# Altium schematic sheet ESP32headerboard.SchDoc
size A4; SheetNumber: 1; SheetTotal: 1
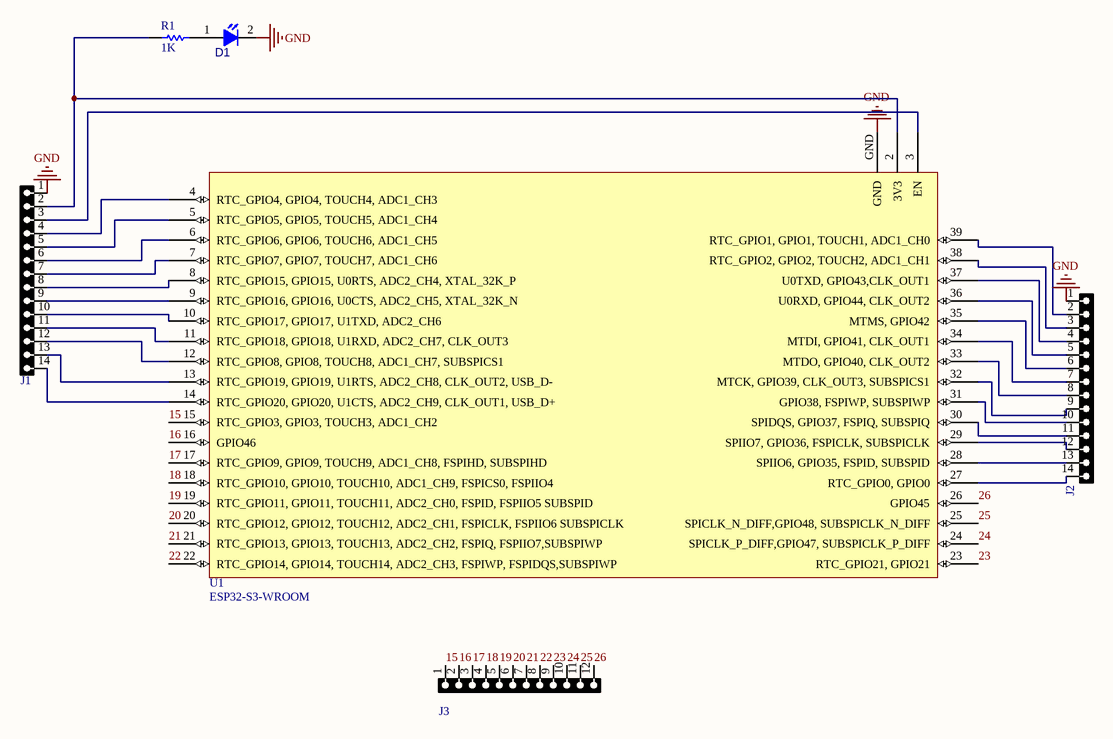
[diagram p0: ESP32headerboard.SchDoc]

## Parts
D1  LED SMD 1206  [LED SMD 1206 (Blue)]  (value not drawn)
J1  HDRF14  [HDR 1X14]  (value not drawn)
J2  HDRF14  [HDR 1X14]  (value not drawn)
J3  HDRF12  [HDR 1X12]  (value not drawn)
R1  value 1K  [SMD-1206-RES]  (hidden comment: Resistor SMD 1206)
U1  ESP32-S3-WROOM  [ESP32-S3-WROOM-1U-N8R8]

## Nets
GND: D1.2(CATHODE) J1.1 J2.1 U1.GND
15: J3.1 U1.15(RTC_GPIO3,_GPIO3,_TOUCH3,_ADC1_CH2)
16: J3.2 U1.16(GPIO46)
17: J3.3 U1.17(RTC_GPIO9,_GPIO9,_TOUCH9,_ADC1_CH8,_FSPIHD,_SUBSPIHD)
18: J3.4 U1.18(RTC_GPIO10,_GPIO10,_TOUCH10,_ADC1_CH9,_FSPICS0,_FSPIIO4)
19: J3.5 U1.19(RTC_GPIO11,_GPIO11,_TOUCH11,_ADC2_CH0,_FSPID,_FSPIIO5_SUBSPID)
20: J3.6 U1.20(RTC_GPIO12,_GPIO12,_TOUCH12,_ADC2_CH1,_FSPICLK,_FSPIIO6_SUBSPICLK)
21: J3.7 U1.21(RTC_GPIO13,_GPIO13,_TOUCH13,_ADC2_CH2,_FSPIQ,_FSPIIO7,SUBSPIWP)
22: J3.8 U1.22(RTC_GPIO14,_GPIO14,_TOUCH14,_ADC2_CH3,_FSPIWP,_FSPIDQS,SUBSPIWP)
23: J3.9 U1.23(RTC_GPIO21,_GPIO21)
24: J3.10 U1.24(SPICLK_P_DIFF,GPIO47,_SUBSPICLK_P_DIFF)
25: J3.11 U1.25(SPICLK_N_DIFF,GPIO48,_SUBSPICLK_N_DIFF)
26: J3.12 U1.26(GPIO45)
NetD1_1: D1.1(ANODE) R1.2
NetJ1_2: J1.2 R1.1 U1.2(3V3)
NetJ1_3: J1.3 U1.3(EN)
NetJ1_4: J1.4 U1.4(RTC_GPIO4,_GPIO4,_TOUCH4,_ADC1_CH3)
NetJ1_5: J1.5 U1.5(RTC_GPIO5,_GPIO5,_TOUCH5,_ADC1_CH4)
NetJ1_6: J1.6 U1.6(RTC_GPIO6,_GPIO6,_TOUCH6,_ADC1_CH5)
NetJ1_7: J1.7 U1.7(RTC_GPIO7,_GPIO7,_TOUCH7,_ADC1_CH6)
NetJ1_8: J1.8 U1.8(RTC_GPIO15,_GPIO15,_U0RTS,_ADC2_CH4,_XTAL_32K_P)
NetJ1_9: J1.9 U1.9(RTC_GPIO16,_GPIO16,_U0CTS,_ADC2_CH5,_XTAL_32K_N)
NetJ1_10: J1.10 U1.10(RTC_GPIO17,_GPIO17,_U1TXD,_ADC2_CH6)
NetJ1_11: J1.11 U1.11(RTC_GPIO18,_GPIO18,_U1RXD,_ADC2_CH7,_CLK_OUT3)
NetJ1_12: J1.12 U1.12(RTC_GPIO8,_GPIO8,_TOUCH8,_ADC1_CH7,_SUBSPICS1)
NetJ1_13: J1.13 U1.13(RTC_GPIO19,_GPIO19,_U1RTS,_ADC2_CH8,_CLK_OUT2,_USB_D-)
NetJ1_14: J1.14 U1.14(RTC_GPIO20,_GPIO20,_U1CTS,_ADC2_CH9,_CLK_OUT1,_USB_D+)
NetJ2_2: J2.2 U1.39(RTC_GPIO1,_GPIO1,_TOUCH1,_ADC1_CH0)
NetJ2_3: J2.3 U1.38(RTC_GPIO2,_GPIO2,_TOUCH2,_ADC1_CH1)
NetJ2_4: J2.4 U1.37(U0TXD,_GPIO43,CLK_OUT1)
NetJ2_5: J2.5 U1.36(U0RXD,_GPIO44,_CLK_OUT2)
NetJ2_6: J2.6 U1.35(MTMS,_GPIO42)
NetJ2_7: J2.7 U1.34(MTDI,_GPIO41,_CLK_OUT1)
NetJ2_8: J2.8 U1.33(MTDO,_GPIO40,_CLK_OUT2)
NetJ2_9: J2.9 U1.32(MTCK,_GPIO39,_CLK_OUT3,_SUBSPICS1)
NetJ2_10: J2.10 U1.31(GPIO38,_FSPIWP,_SUBSPIWP)
NetJ2_11: J2.11 U1.30(SPIDQS,_GPIO37,_FSPIQ,_SUBSPIQ)
NetJ2_12: J2.12 U1.29(SPIIO7,_GPIO36,_FSPICLK,_SUBSPICLK)
NetJ2_13: J2.13 U1.28(SPIIO6,_GPIO35,_FSPID,_SUBSPID)
NetJ2_14: J2.14 U1.27(RTC_GPIO0,_GPIO0)

## Library data of the parts
D1 = LED SMD 1206: Designed by:: MJKhodami; ComponentLink1Description: Our website:; ComponentLink1URL: https://www.spaceomid.com/
J1 J2 = HDR_1X14: CONN, HEADER, Female, pitch: 2.54mm, 14POS; Designed by:: MJKhodami; VALUE: HDRF14; ComponentLink1Description: Our website:; ComponentLink1URL: https://www.spaceomid.com/
J3 = HDR_1X12: CONN, HEADER, Female, pitch: 2.54mm, 12POS; Designed by:: MJKhodami; VALUE: HDRF12; ComponentLink1Description: Our website:; ComponentLink1URL: https://www.spaceomid.com/
R1 = Resistor SMD 1206: Designed by:: MJKhodami; ComponentLink3Description: Our Website:; ComponentLink3URL: https://www.spaceomid.com/
U1 = ESP32-S3-WROOM-1U-N8R8: Designed by:: MJKhodami; ComponentLink1Description: Our website; ComponentLink1URL: https://www.spaceomid.com/